# Altium schematic sheet MCU_REV2.SchDoc
size A4; SheetNumber: 1; SheetTotal: 11
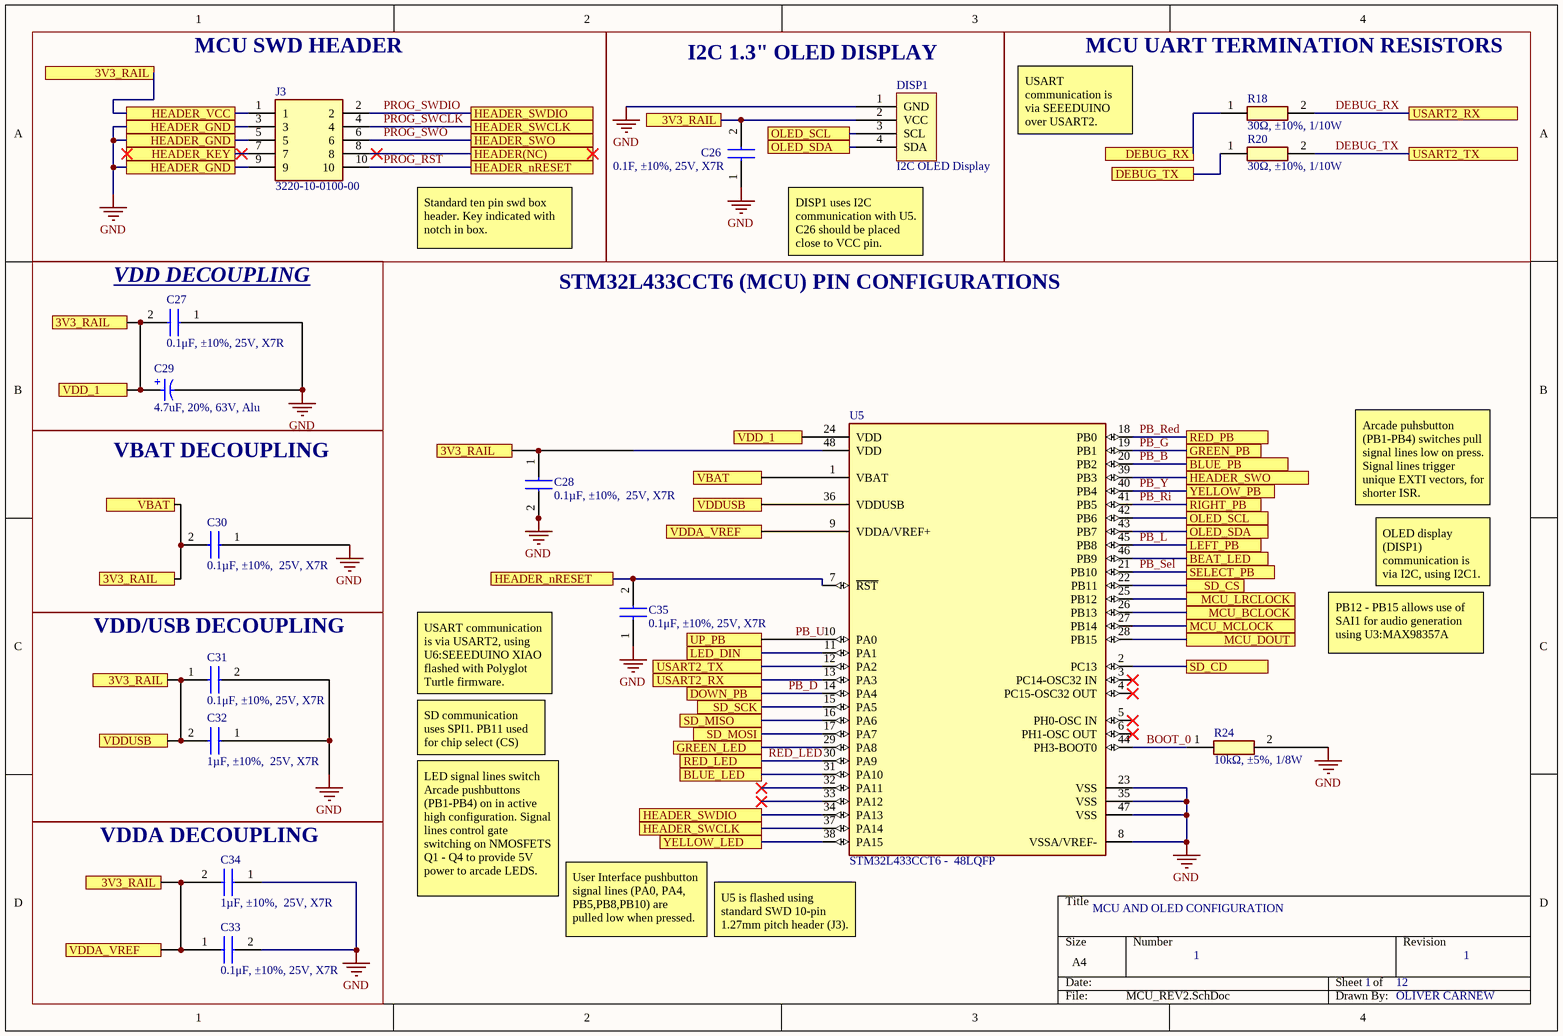
[diagram p0: MCU_REV2.SchDoc]

## Parts
C26  0.1F, ±10%, 25V, X7R  [CAPC1005X55N]
C27  0.1μF, ±10%, 25V, X7R  [CAPC1005X55N]
C28  0.1µF, ±10%,  25V, X7R  [CAPC1005X55N]
C29  4.7uF, 20%, 63V, Alu  [WCAP-ATG5_D5H11]
C30  0.1µF, ±10%,  25V, X7R  [CAPC1005X55N]
C31  0.1μF, ±10%, 25V, X7R  [CAPC1005X55N]
C32  1µF, ±10%,  25V, X7R  [CAPC1608X90N]
C33  0.1μF, ±10%, 25V, X7R  [CAPC1005X55N]
C34  1µF, ±10%,  25V, X7R  [CAPC1608X90N]
C35  0.1μF, ±10%, 25V, X7R  [CAPC1005X55N]
DISP1  I2C OLED Display  [OLED_I2C_4pinHEADER]
J3  3220-10-0100-00  [322010010000]
R18  30Ω, ±10%, 1/10W  [RESC1608X55N]
R20  30Ω, ±10%, 1/10W  [RESC1608X55N]
R24  10kΩ, ±5%, 1/8W  [RESC2012X60N]
U5  STM32L433CCT6 -  48LQFP  [FP-LQFP48-5B-MFG]

## Blocks framed on the sheet
MCU SWD HEADER: J3
I2C 1.3" OLED DISPLAY: C26 DISP1
MCU UART TERMINATION RESISTORS: R18 R20
VDD DECOUPLING: C27 C29
VBAT DECOUPLING: C30
VDD/USB DECOUPLING: C31 C32
VDDA DECOUPLING: C33 C34

## Ports
3V3_RAIL, BEAT_LED, BLUE_LED, BLUE_PB, DEBUG_RX, DEBUG_TX, DOWN_PB, GREEN_LED, GREEN_PB, HEADER(NC), HEADER_GND, HEADER_KEY, HEADER_nRESET, HEADER_SWCLK, HEADER_SWDIO, HEADER_SWO, HEADER_VCC, LED_DIN, LEFT_PB, MCU_BCLOCK, MCU_DOUT, MCU_LRCLOCK, MCU_MCLOCK, OLED_SCL, OLED_SDA, RED_LED, RED_PB, RIGHT_PB, SD_CD, SD_CS, SD_MISO, SD_MOSI, SD_SCK, SELECT_PB, UP_PB, USART2_RX, USART2_TX, VBAT, VDD_1, VDDA_VREF, VDDUSB, YELLOW_LED, YELLOW_PB

## Nets
GND: C26.1 C27.1 C28.2 C29.2(N) C30.1 C31.2 C32.1 C33.2 C34.1 C35.1 DISP1.1(GND) J3.3 J3.5 J3.9 R24.2 U5.8(VSSA/VREF-) U5.23(VSS) U5.35(VSS) U5.47(VSS) ; port HEADER_GND
3V3_RAIL: C26.2 C27.2 C28.1 C29.1(P) C30.2 C31.1 C32.2 C33.1 C34.2 DISP1.2(VCC) J3.1 U5.1(VBAT) U5.9(VDDA/VREF+) U5.24(VDD) U5.36(VDDUSB) U5.48(VDD) ; port HEADER_VCC, port 3V3_RAIL, port VBAT, port VDDUSB, port VDDA_VREF, port VDD_1
BEAT_LED: U5.46(PB9) ; port BEAT_LED
BLUE_LED: U5.31(PA10) ; port BLUE_LED
BOOT_0: R24.1 U5.44(PH3-BOOT0)
DEBUG_RX: R18.2 U5.13(PA3) ; port USART2_RX
DEBUG_RX: R18.1 ; port DEBUG_RX  [a separate net that carries the same name]
DEBUG_TX: R20.2 U5.12(PA2) ; port USART2_TX
DEBUG_TX: R20.1 ; port DEBUG_TX  [a separate net that carries the same name]
GREEN_LED: U5.29(PA8) ; port GREEN_LED
HEADER(NC): J3.8 ; port HEADER(NC)
HEADER_KEY: J3.7 ; port HEADER_KEY
LED_DIN: U5.11(PA1) ; port LED_DIN
MCU_BCLOCK: U5.26(PB13) ; port MCU_BCLOCK
MCU_DOUT: U5.28(PB15) ; port MCU_DOUT
MCU_LRCLOCK: U5.25(PB12) ; port MCU_LRCLOCK
MCU_MCLOCK: U5.27(PB14) ; port MCU_MCLOCK
OLED_SCL: DISP1.3(SCL) U5.42(PB6) ; port OLED_SCL
OLED_SDA: DISP1.4(SDA) U5.43(PB7) ; port OLED_SDA
PB_B: U5.20(PB2) ; port BLUE_PB
PB_D: U5.14(PA4) ; port DOWN_PB
PB_G: U5.19(PB1) ; port GREEN_PB
PB_L: U5.45(PB8) ; port LEFT_PB
PB_Red: U5.18(PB0) ; port RED_PB
PB_Ri: U5.41(PB5) ; port RIGHT_PB
PB_Sel: U5.21(PB10) ; port SELECT_PB
PB_U: U5.10(PA0) ; port UP_PB
PB_Y: U5.40(PB4) ; port YELLOW_PB
PROG_RST: C35.2 J3.10 U5.7(~{RST}) ; port HEADER_nRESET
PROG_SWCLK: J3.4 U5.37(PA14) ; port HEADER_SWCLK
PROG_SWDIO: J3.2 U5.34(PA13) ; port HEADER_SWDIO
PROG_SWO: J3.6 U5.39(PB3) ; port HEADER_SWO
RED_LED: U5.30(PA9) ; port RED_LED
SD_CD: U5.2(PC13) ; port SD_CD
SD_CS: U5.22(PB11) ; port SD_CS
SD_MISO: U5.16(PA6) ; port SD_MISO
SD_MOSI: U5.17(PA7) ; port SD_MOSI
SD_SCK: U5.15(PA5) ; port SD_SCK
YELLOW_LED: U5.38(PA15) ; port YELLOW_LED

Not connected (* = marked no-connect by the designer): U5 3(PC14-OSC32_IN)* 4(PC15-OSC32_OUT)* 5(PH0-OSC_IN)* 6(PH1-OSC_OUT)* 32(PA11)* 33(PA12)*

## Notes on the sheet
- USART communication is via SEEEDUINO over USART2.
- Standard ten pin swd box header. Key indicated with notch in box.
- DISP1 uses I2C communication with U5. C26 should be placed close to VCC pin.
- STM32L433CCT6 (MCU) PIN CONFIGURATIONS
- Arcade puhsbutton (PB1-PB4) switches pull signal lines low on press. Signal lines trigger unique EXTI vectors, for shorter ISR.
- OLED display (DISP1) communication is via I2C, using I2C1.
- PB12 - PB15 allows use of SAI1 for audio generation using U3:MAX98357A
- USART communication is via USART2, using U6:SEEEDUINO XIAO flashed with Polyglot Turtle firmware.
- SD communication uses SPI1. PB11 used for chip select (CS)
- LED signal lines switch Arcade pushbuttons (PB1-PB4) on in active high configuration. Signal lines control gate switching on NMOSFETS Q1 - Q4 to provide 5V power to arcade LEDS.
- MCU AND OLED CONFIGURATION
- User Interface pushbutton signal lines (PA0, PA4, PB5,PB8,PB10) are pulled low when pressed.
- (near U5) U5 is flashed using standard SWD 10-pin 1.27mm pitch header (J3).
- 1
- 12
- OLIVER CARNEW
- (in symbol CMP-03913-53914231-1) +

## Library data of the parts
C26-C28 C30 C31 C33 C35 = CL05B104KA5NNNC: Capacitor CAP CER 0.1UF 25V X7R 0402 CL05B104KA5NNNC; Manufacturer_Name: SAMSUNG; Datasheet Link: https://datasheet.datasheetarchive.com/originals/distributors/DKDS-19/372989.pdf; Height: 0.55mm; Manufacturer_Part_Number: CL05B104KA5NNNC; Mouser Part Number: 187-CL05B104KA5NNNC; Mouser Price/Stock: https://www.mouser.co.uk/ProductDetail/Samsung-Electro-Mechanics/CL05B104KA5NNNC?qs=Efv9o2T6U88DLyyMSzjXSQ%3D%3D; Arrow Part Number: CL05B104KA5NNNC; Arrow Price/Stock: https://www.arrow.com/en/products/cl05b104ka5nnnc/samsung-electro-mechanics?region=nac; Parameter 1: Capacitor CAP CER 0.1UF 25V X7R 0402 CL05B104KA5NNNC
C29 = CMP-03913-53914231-1: 860020672008 WCAP-ATG5 Aluminum Electrolytic Capacitors860020672008; Pitch: 2mm; Ripple Current: 32mA; Voltage Rating: 50V; Life (Hours): 2000hours; Leakage Current: 3µA; Capacitance: 4.7µF; Polarity: Polar; Min Operating Temperature: -40°C; Case/Package: Radial; Packaging: Tape & Box (TB); Tolerance: 20%; Height: 11mm; Lead Pitch: 2.0066mm; Diameter: 5mm; NexarPartId: 53914231; REACH SVHC: Unknown; Voltage Rating (DC): 50V; Mount: Through Hole; Height - Seated (Max): 12.4968mm; Length: 11mm; Max Operating Temperature: 105°C; RoHS: Compliant
C32 C34 = CL10B105KA8NNNC: Capacitor 1 µF ±10% 25V Ceramic Capacitor X7R 0603 (1608 Metric) CL10B105KA8NNNC; Manufacturer_Name: SAMSUNG; Datasheet Link: https://datasheet.datasheetarchive.com/originals/distributors/Datasheets-DGA10/2410489.pdf; Height: 0.9mm; Manufacturer_Part_Number: CL10B105KA8NNNC; Mouser Part Number: 187-CL10B105KA8NNNC; Mouser Price/Stock: https://www.mouser.co.uk/ProductDetail/Samsung-Electro-Mechanics/CL10B105KA8NNNC?qs=349EhDEZ59qp%252BMgnTol5Nw%3D%3D; Arrow Part Number: CL10B105KA8NNNC; Arrow Price/Stock: https://www.arrow.com/en/products/cl10b105ka8nnnc/samsung-electro-mechanics?region=nac; Parameter 1: 1 µF ±10% 25V Ceramic Capacitor X7R 0603 (1608 Metric)
DISP1 = OLED_I2C_4pinHEADER: OLED_I2C_4pinHEADER Large clear space
J3 = 3220-10-0100-00: Connector; Manufacturer_Name: CNC Tech; Datasheet Link: https://datasheet.datasheetarchive.com/originals/dk/DKDS-7/133059.pdf; Height: 5.6mm; Manufacturer_Part_Number: 3220-10-0100-00; Arrow Part Number: 3220-10-0100-00; Arrow Price/Stock: https://www.arrow.com/en/products/3220-10-0100-00/cnc-tech-llc?utm_currency=USD&region=nac
R18 R20 = ERJPA3F30R0V: Resistor ERJPA3F30R0V 30 Ohms ±1% 0.333W, 1/3W Chip Resistor 0603 (1608 Metric) Automotive AEC-Q200, Pulse Withstanding Thick Film; Manufacturer_Name: Panasonic; Datasheet Link: https://industrial.panasonic.com/cdbs/www-data/pdf/RDA0000/AOA0000C243.pdf; Height: 0.55mm; Manufacturer_Part_Number: ERJPA3F30R0V; Arrow Part Number: ERJPA3F30R0V; Arrow Price/Stock: https://www.arrow.com/en/products/erj-pa3f30r0v/panasonic; Parameter 1: Resistor ERJPA3F30R0V 30 Ohms ±1% 0.333W, 1/3W Chip Resistor 0603 (1608 Metric) Automotive AEC-Q200, Pulse Withstanding Thick Film
R24 = RC0805JR-0710KL: Resistor RES 10K OHM 5% 1/8W 0805  RC0805JR-0710KL; Manufacturer_Name: YAGEO; Datasheet Link: https://componentsearchengine.com/Datasheets/2/RC0805JR-0710KL.pdf; Height: 0.6mm; Manufacturer_Part_Number: RC0805JR-0710KL; Mouser Part Number: 603-RC0805JR-0710KL; Mouser Price/Stock: https://www.mouser.co.uk/ProductDetail/YAGEO/RC0805JR-0710KL?qs=ZFGQJeMQzF5q%2Fp77vM%2FrVQ%3D%3D; Arrow Part Number: RC0805JR-0710KL; Arrow Price/Stock: https://www.arrow.com/en/products/rc0805jr-0710kl/yageo?region=nac
U5 = CMP-12105-000047-1: IC MCU 32BIT 256KB FLASH 48LQFP; Manufacturer: STMicroelectronics; Max Junction Temp: +105°C; Min Supply Voltage: 1.55V; Number Of Uart Channels: 4; Number Of I2C Channels: 3; Max Supply Voltage: 3.6V; Number Of I/Os: 38; Number Of Usb Channels: 1; Memory Size: 256KBytes; Interface: I2C,SPI,UART,USART,CAN,USB,LIN,IrDA,SMBus,Other; Ram Size: 64KBytes; Standoff Height: 0.05mm; Number Of Pwm Channels: 14; Number Of Timers/Counters: 9; Frequency: 80MHz; Data Bus Width: 32bits; Number Of Adc Channels: 10; Core Architecture: Arm Cortex-M4; Digikey Description: IC MCU 32BIT 256KB FLASH 48LQFP; Category: IC; Ambient Temperature Range High: +85°C; Number Of Spi Channels: 3; Temperature Range High: +85°C; ComponentLink2Description: Datasheet; Device Class L3: Microcontrollers; Device Class L2: Embedded Processors and Controllers; Temperature Range Low: -40°C; Ambient Temperature Range Low: -40°C; Manufacturer Part Number: STM32L433CCT6; Automotive: No; Package: LQFP48-5B; Ipc Land Pattern Name: QFP50P900X900X160-48; RoHS: TRUE; Octopart: https://octopart.com/stm32l433cct6-stmicroelectronics-71093511; Number Of A/D Converters: 1; Memory Type: FLASH; Lead Free: Yes; ComponentLink2URL: https://www.st.com/resource/en/datasheet/stm32l433cc.pdf; Device Class L1: Integrated Circuits (ICs); Temperature: -40°C to +85°C; Number Of Cores: 1; Height: 1.6mm